# Altium schematic sheet USB_PWR_CLK.SchDoc
size A; SheetNumber: 2; SheetTotal: 3
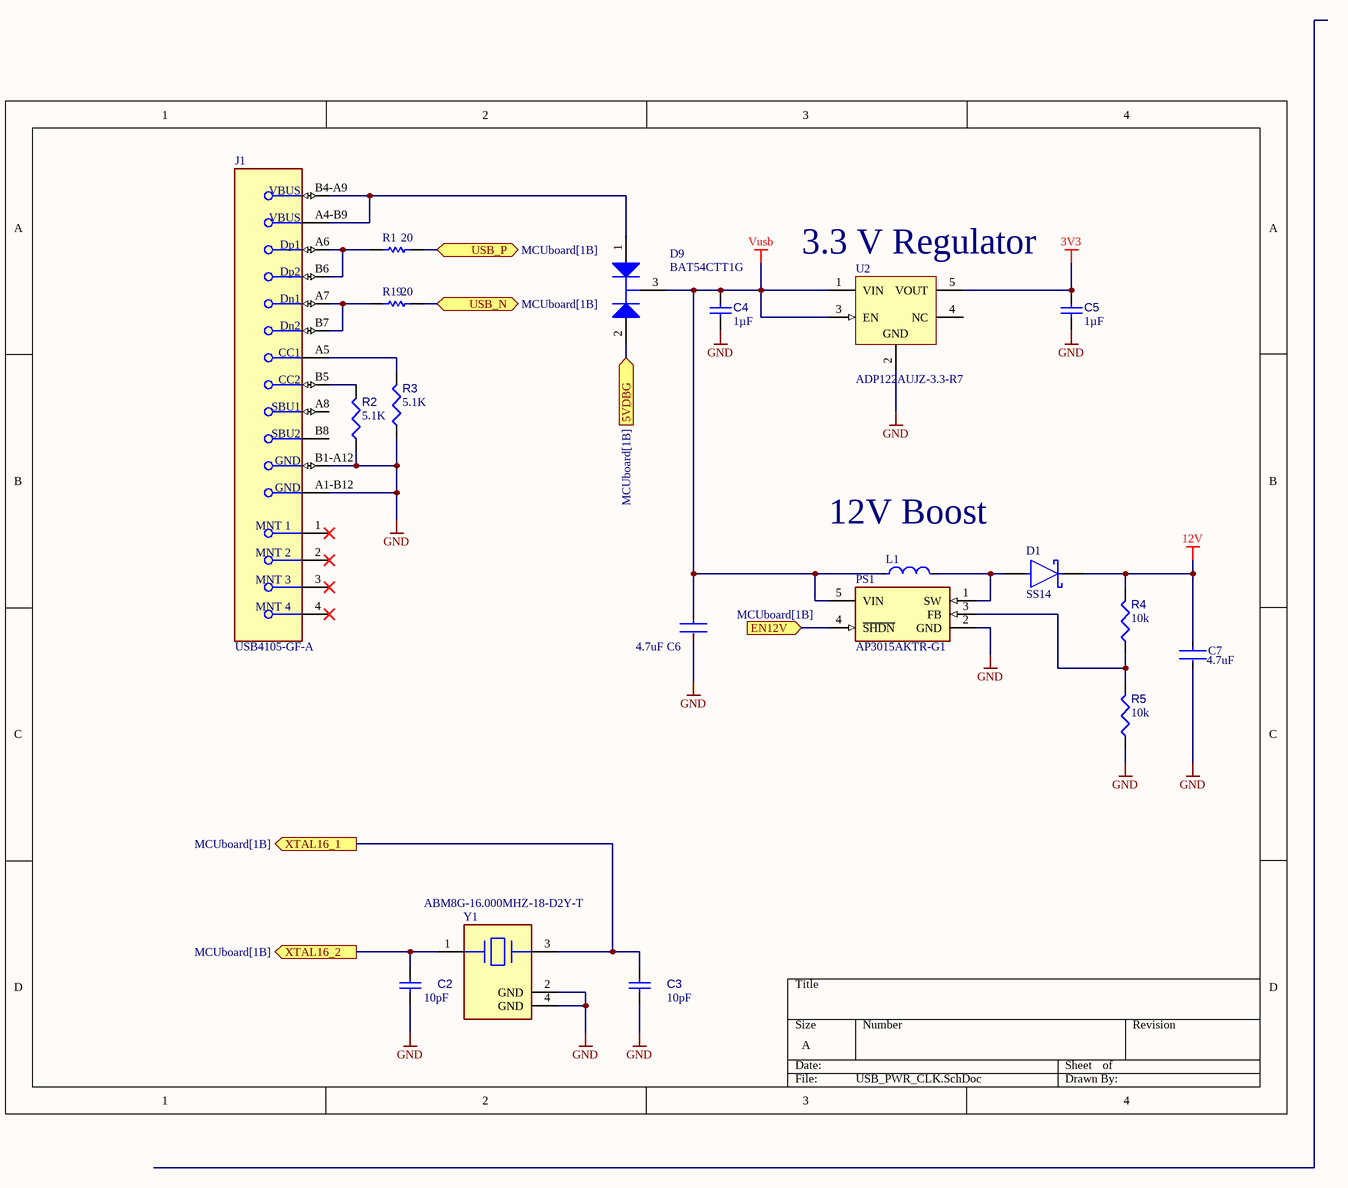
[diagram p0: USB_PWR_CLK.SchDoc]

## Parts
C2  value 10pF  [CAPC1608X87X35NL15T15]  (hidden comment: Capacitor 10 pF +/- 0.25 pF 50 V 0603)
C3  value 10pF  [CAPC1608X87X35NL15T15]  (hidden comment: Capacitor 10 pF +/- 0.25 pF 50 V 0603)
C4  value 1µF  [CAPC1608X90X35ML15T15]  (hidden comment: Capacitor 1uF +/- 10% 16V 0603)
C5  value 1µF  [CAPC1608X90X35ML15T15]  (hidden comment: Capacitor 1uF +/- 10% 16V 0603)
C6  Capacitance: 4.7uF  [FP-GRM188-0_15-IPC_C]  (hidden comment: GRM188R61E475KE11D)
C7  Capacitance: 4.7uF  [FP-GRM188-0_15-IPC_C]  (hidden comment: GRM188R61E475KE11D)
D1  SS14  [FP-403AE-MFG]
D9  BAT54CTT1G  [ONSC-SC-75-3-463-01_V]
J1  USB4105-GF-A  [FP-USB4105-GF-A-MFG]
L1  MLZ2012N100LT000  [FP-MLZ2012-1_25-MFG]  (value not drawn)
PS1  AP3015AKTR-G1  [SOT95P280X145-5N]
R1  Resistance: 20  [RESC1609X55X30LL15T15]  (hidden comment: ERJ3EKF1002V)
R2  value 5.1K  [RESC1608X55X25ML10T15]  (hidden comment: Resistor 10k +/-1% 0603 100 mW)
R3  value 5.1K  [RESC1608X55X25ML10T15]  (hidden comment: Resistor 10k +/-1% 0603 100 mW)
R4  value 10k  [RESC1608X55X25ML10T15]  (hidden comment: Resistor 10k +/-1% 0603 100 mW)
R5  value 10k  [RESC1608X55X25ML10T15]  (hidden comment: Resistor 10k +/-1% 0603 100 mW)
R19  Resistance: 20  [RESC1609X55X30LL15T15]  (hidden comment: ERJ3EKF1002V)
U2  ADP122AUJZ-3.3-R7  [ADI-UJ-5_M]
Y1  ABM8G-16.000MHZ-18-D2Y-T  [FP-ABM8G-MFG]

## Ports
5VDBG (in, see MCUboard[1B]), EN12V (in, see MCUboard[1B]), USB_N (bidir, see MCUboard[1B]), USB_P (bidir, see MCUboard[1B]), XTAL16_1 (out, see MCUboard[1B]), XTAL16_2 (out, see MCUboard[1B])

## Nets
3V3: C5.2 U2.5(VOUT)
12V: C7.1 D1.2(C) R4.2
GND: C2.2 C3.2 C4.1 C5.1 C6.2 C7.2 J1.A1-B12(GND) J1.B1-A12(GND) PS1.2(GND) R2.1 R3.1 R5.1 U2.2(GND) Y1.2(GND) Y1.4(GND)
Vusb: C4.2 C6.1 D9.3(K) L1.1 PS1.5(VIN) U2.1(VIN) U2.3(EN)
5VDBG: D9.2(A2) ; port 5VDBG
EN12V: PS1.4(~{SHDN}) ; port EN12V
USB_N: R19.1 ; port USB_N
USB_P: R1.1 ; port USB_P
XTAL16_1: C3.1 Y1.3 ; port XTAL16_1
XTAL16_2: C2.1 Y1.1 ; port XTAL16_2
NetD1_1: D1.1(A) L1.2 PS1.1(SW)
NetD9_1: D9.1(A1) J1.A4-B9(VBUS) J1.B4-A9(VBUS)
NetJ1_A5: J1.A5(CC1) R3.2
NetJ1_A6: J1.A6(Dp1) J1.B6(Dp2) R1.2
NetJ1_A7: J1.A7(Dn1) J1.B7(Dn2) R19.2
NetJ1_B5: J1.B5(CC2) R2.2
NetPS1_3: PS1.3(FB) R4.1 R5.2

Not connected (* = marked no-connect by the designer): J1 1(MNT_1)* 2(MNT_2)* 3(MNT_3)* 4(MNT_4)* A8(SBU1) B8(SBU2); U2 4(NC)

## Notes on the sheet
- 3.3 V Regulator
- 12V Boost

## Library data of the parts
C2 C3 = CMP-001-00012-7: Chip Capacitor, 10 pF, +/- 0.25 pF, 50 V, 0603 (1608 Metric); Tolerance: 0.25%; Capacitor Type: Ceramic; Voltage Rating: 50V; Max Operating Temperature: 125°C; RoHS Compliant: True; Mounting Technology: SM; Pins: 2; Case/Package: 0603; Min Operating Temperature: -55°C
C4 C5 = CMP-001-00004-7: Chip Capacitor, 1 uF, +/- 10%, 16 V, 0603 (1608 Metric); Capacitor Type: Ceramic; Mounting Technology: SM; RoHS Compliant: True; Min Operating Temperature: -55°C; Case/Package: 0603; Pins: 2; Voltage Rating: 16V; Max Operating Temperature: 125°C; Tolerance: 10%
C6 C7 = CMP-2006-02523-2: Chip Multilayer Ceramic Capacitors for General Purpose, 0603, 4.7uF, X5R, 15%, 10%, 25V; Case Code (Metric): 1608; Max Operating Temperature: 85°C; REACH SVHC: No SVHC; Voltage Rating: 25V; Dielectric: X5R; Packaging: Cut Tape; Width: 0.031inch; Min Operating Temperature: -55°C; Lead Free: Lead Free; Height: 0.8mm; Case Code (Imperial): 0603; Length: 1.6mm; Voltage Rating (DC): 25V; Case/Package: 0603; Voltage: 25V; Tolerance: 10%; Thickness: 0.031inch; Mount: Surface Mount; Material: Ceramic; Package Quantity: 4000; Depth: 0.8mm
D1 = CMP-2000-04943-2: DIODE SCHOTTKY 40V 1A SMA; Manufacturer: ON Semiconductor; Peak Reverse Current: 0.2mA; Max Junction Temp: +125°C; Standoff Height: 0.05mm; Max Surge Forward Current: 40A; Mouser Description: Schottky Diodes & Rectifiers SMA 40V 1.0A; RoHS: TRUE; Lead Free: Yes; Manufacturer Part Number: SS14; Device Class L3: Schottky Diodes; Category: Diode; Automotive: No; Digikey Description: DIODE SCHOTTKY 40V 1A SMA; ComponentLink2Description: Datasheet; Device Class L2: Diodes; Height: 2.5mm; Temperature Range High: +125°C; ComponentLink2URL: https://www.onsemi.com/pub/Collateral/SS19-D.PDF; Device Class L1: Discrete Semiconductors; Package: 403AE; Octopart: https://octopart.com/ss14-on+semiconductor-29205033; Max Repetitive Reverse Voltage: 40V; Temperature Range Low: -65°C; Forward Current: 1A; Temperature: -65°C to +125°C
D9 = CMP-1055-00298-1: Dual Series Cathode Schottky Barrier Diodes, 3-Pin SC-75, Pb-Free, Tape and Reel; Manufacturer: On Semiconductor; trr Max (ns): 5; Configuration: Common Cathode; IFSM Max (A): 0.6; Packing: Tape and Reel; PackageReference: SC-75-3-463-01; PackageVersion: Rev. F, 07/2005; ComponentLink3URL: http://www.onsemi.com/pub_link/Collateral/463-01.PDF; ComponentLink1URL: http://www.onsemi.com/; RoHS: TRUE; ComponentLink2URL: http://www.onsemi.cn/pub_link/Collateral/BAT54CTT1-D.PDF; Mounting Technology: Surface Mount; PartNumber: BAT54CTT1G; DatasheetVersion: Rev. 4; PackageDescription: 3-Pin Small Outline Transistor, Body 1.6 x 0.8 mm, Pitch 0.5 mm; ComponentLink2Description: Datasheet; ComponentLink3Description: Package Specification; ComponentLink1Description: Manufacturer URL
J1 = CMP-002-00072-3: Conn USB 2.0 Type C RCP 24 POS 0.3mm/0.5mm Solder RA SMD 24 Terminal 1 Port T/R
L1 = CMP-08253-000052-1: Shielded Multilayer Inductor 10uH ±20% 500mA 390mΩ SMD 0805; Self Resonant Frequency: 50MHz; Core Material: Ferrite; Test Frequency: 2MHz; Saturation Current: 110mA; DC Resistance (DCR): 390mR; Current Rating: 500mA; Case Code (Metric): 2012; Package Quantity: 1; RoHS Compliant: Yes; Tolerance: 20%; Height - Seated (Max): 0.057inch; Case/Package: 0805; Width: 0.049inch; Mount: Surface Mount; Max Operating Temperature: 125°C; Inductance: 10uH; Packaging: Tape and Reel; Length: 0.079inch; Min Operating Temperature: -55°C; Case Code (Imperial): 0805; Shielding: Shielded
PS1 = AP3015AKTR-G1: Power Supply; Manufacturer_Name: Diodes Inc.; Datasheet Link: https://www.diodes.com/assets/Datasheets/AP3015_A.pdf; Height: 1.45mm; Manufacturer_Part_Number: AP3015AKTR-G1; Mouser Part Number: 621-AP3015AKTR-G1; Mouser Price/Stock: https://www.mouser.co.uk/ProductDetail/Diodes-Incorporated/AP3015AKTR-G1?qs=x6A8l6qLYDBKZpaE8%2FwCMQ%3D%3D; Arrow Part Number: AP3015AKTR-G1; Arrow Price/Stock: https://www.arrow.com/en/products/ap3015aktr-g1/diodes-incorporated?region=nac
R1 R19 = CMP-1012-00623-3: Chip Resistor, 10 KOhm, +/- 1%, 0.1 W, -55 to 155 degC, 0603 (1608 Metric), RoHS, Tape and Reel; Manufacturer: Panasonic; Voltage Rating: 75V; Case\/Package: 0603; Power Rating: 100mW; Temperature Coefficient: 100ppm\/degreesC; Number of Pins: 2; Package Reference: 603; Depth: 0.8mm; Mount: SurfaceMount; Package Description: 2-Pin Surface Mount Device, Body 1.6 x 0.85 mm; Datasheet Version: 02/2017; Length: 1.6mm; Lead Free: LeadFree; Height: 0.45mm; Number of Terminations: 2; Max Power Dissipation: 100mW; Min Operating Temperature: -55degC; Datasheet URL: https://industrial.panasonic.com/cdbs/www-data/pdf/RDA0000/AOA0000C304.pdf; Termination: SMD/SMT; Case Code (Metric): 1608; Case Code (Imperial): 0603; Tolerance: 1%; Max Operating Temperature: 155degC; RoHSCompliant: true; Voltage Rating (DC): 75V; Radiation Hardening: No; Packaging: TapeandReel; Composition: ThickFilm; Mounting Technology: SurfaceMount; Manufacturer URL: http://www.panasonic.com/; Width: 0.031inch; REACH SVHC: NoSVHC; Contact Plating: Tin; Military Standard: Not; Package Quantity: 1
R2-R5 = CMP-009-00017-5: Chip Resistor, 10 KOhm, +/- 1%, 01 W, -55 to 155 degC, 0603 (1608 Metric); Voltage Rating: 50V; Power: 100mW; RoHS Compliant: True; Min Operating Temperature: -55°C; Pins: 2; Case/Package: 0603; Mounting Technology: SM; Max Operating Temperature: 155°C; Tolerance: 1%
U2 = CMP-0786-00346-1: 300 mA, Low Quiescent Current, CMOS Linear Regulator, 2.3 to 5.5 V Vin, 3.3 V Vout, Industrial, 5-pin SOT23 (UJ-5), Reel; Manufacturer: Analog Devices; Vin (min) (V): 2.3; Supply Current IGND @ Small Load: 45uA; Vin (max) (V): 5.5; Iout max: 300mA; Preset Vout Values (V): 3.3; ComponentLink4Description: URL Link1; ComponentLink4URL: Product URL:http://www.analog.com/en/ADP122/productSearch.html; ComponentLink2URL: http://www.analog.com/static/imported-files/data_sheets/ADP122_123.pdf; PackageDescription: 5-Pin Thin Small Outline Transistor Package, Body 2.9 x 1.6 mm, Pitch 0.95 mm; ComponentLink1URL: http://www.analog.com/en/index.html; ComponentLink3URL: http:/www.analog.com/static/imported-files/packages/PKG_PDF/TSOT(UJ)/UJ_5.pdf; ComponentLink2Description: Datasheet; PartNumber: ADP122AUJZ-3.3-R7; Packing: Reel; ComponentLink1Description: Manufacturer URL; Code_JEDEC: MO-193-AB; PackageVersion: 100708-A, 10/2008; PackageReference: UJ-5; Mounting Technology: Surface Mount; DatasheetVersion: Rev. E; ComponentLink3Description: Package Specification
Y1 = CMP-27762-006537-2: Crystal 16MHz ±20ppm (Tol) ±30ppm (Stability) 18pF FUND 80Ω 4-Pin SMD T/R; Series Resistance: 80R; Radiation Hardening: No; Load Capacitance: 18pF; Package Quantity: 1000; Frequency Stability: 30ppm; ESR (Equivalent Series Resistance): 80R; Depth: 2.5mm; Height: 1mm; Number of Pins: 4; Frequency Tolerance: 20ppm; Frequency: 16MHz; Tolerance: 20ppm; Min Operating Temperature: -40°C; Length: 3.2mm; Termination: SMD/SMT; Max Operating Temperature: 85°C; Width: 2.5mm; Series: ABM8G; Mount: Surface Mount; Case/Package: CSMD; Lead Free: Lead Free; Operating Frequency: 16 MHz; Packaging: Tape and Reel